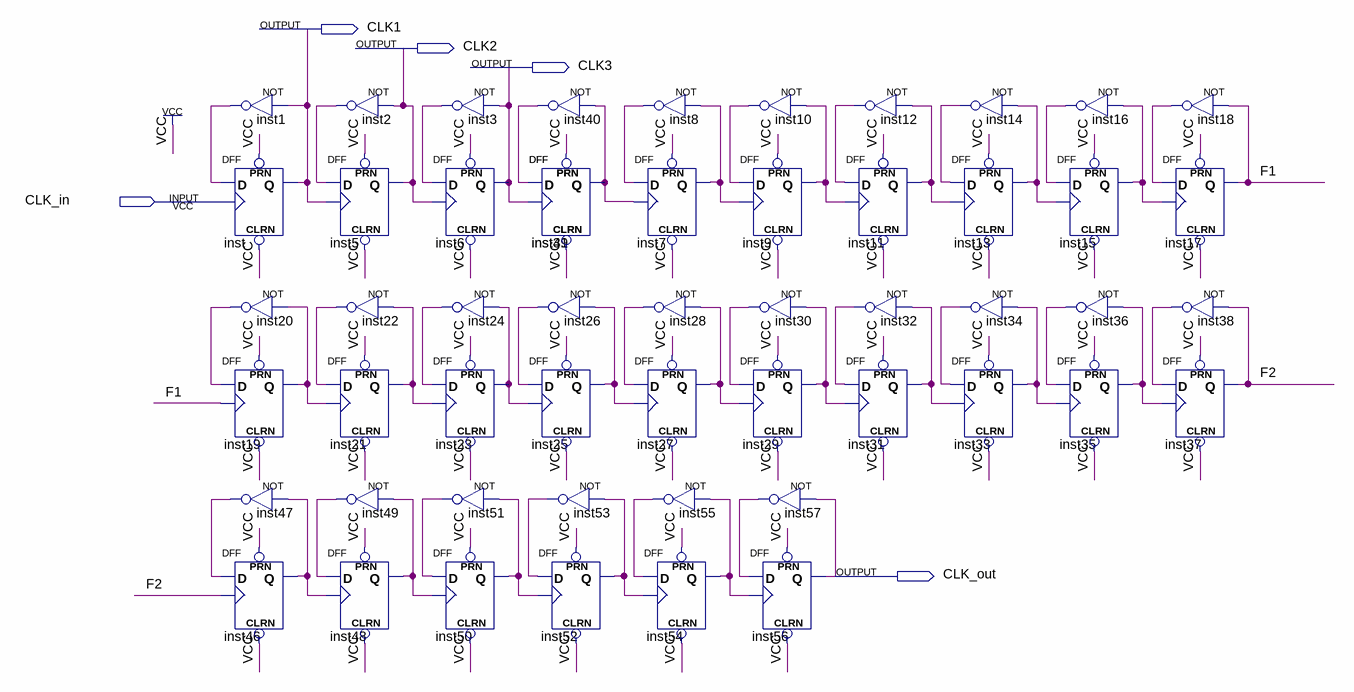
[diagram p0: schematic sheet]
// Quartus schematic divFreq.bdf as structural Verilog: 53 symbols, 5 pins
module divFreq (
  input  CLK_in,
  output CLK1,
  output CLK2,
  output CLK3,
  output CLK_out
);

  wire F1, F2, inst1_out, inst2_out, inst3_out, inst7_q, inst8_out, inst9_q, inst10_out, inst11_q,
       inst12_out, inst13_q, inst14_out, inst15_q, inst16_out, inst18_out, inst19_q, inst20_out, inst21_q,
       inst22_out, inst23_q, inst24_out, inst25_q, inst26_out, inst27_q, inst28_out, inst29_q, inst30_out,
       inst31_q, inst32_out, inst33_q, inst34_out, inst35_q, inst36_out, inst38_out, inst39_q, inst40_out,
       inst46_q, inst47_out, inst48_q, inst49_out, inst50_q, inst51_out, inst52_q, inst53_out, inst54_q,
       inst55_out, inst57_out;

  not inst1 (inst1_out, CLK1);
  DFF inst (.CLRN(1'b1), .CLK(CLK_in), .D(inst1_out), .PRN(1'b1), .Q(CLK1));
  not inst20 (inst20_out, inst19_q);
  DFF inst19 (.CLRN(1'b1), .CLK(F1), .D(inst20_out), .PRN(1'b1), .Q(inst19_q));
  not inst47 (inst47_out, inst46_q);
  DFF inst46 (.CLRN(1'b1), .CLK(F2), .D(inst47_out), .PRN(1'b1), .Q(inst46_q));
  not inst2 (inst2_out, CLK2);
  DFF inst5 (.CLRN(1'b1), .CLK(CLK1), .D(inst2_out), .PRN(1'b1), .Q(CLK2));
  not inst22 (inst22_out, inst21_q);
  DFF inst21 (.CLRN(1'b1), .CLK(inst19_q), .D(inst22_out), .PRN(1'b1), .Q(inst21_q));
  not inst49 (inst49_out, inst48_q);
  DFF inst48 (.CLRN(1'b1), .CLK(inst46_q), .D(inst49_out), .PRN(1'b1), .Q(inst48_q));
  not inst3 (inst3_out, CLK3);
  DFF inst6 (.CLRN(1'b1), .CLK(CLK2), .D(inst3_out), .PRN(1'b1), .Q(CLK3));
  not inst24 (inst24_out, inst23_q);
  DFF inst23 (.CLRN(1'b1), .CLK(inst21_q), .D(inst24_out), .PRN(1'b1), .Q(inst23_q));
  not inst51 (inst51_out, inst50_q);
  DFF inst50 (.CLRN(1'b1), .CLK(inst48_q), .D(inst51_out), .PRN(1'b1), .Q(inst50_q));
  not inst40 (inst40_out, inst39_q);
  DFF inst39 (.CLRN(1'b1), .CLK(CLK3), .D(inst40_out), .PRN(1'b1), .Q(inst39_q));
  DFF inst41 (.CLRN(1'b1), .CLK(CLK3), .D(inst40_out), .PRN(1'b1), .Q(inst39_q));
  not inst26 (inst26_out, inst25_q);
  DFF inst25 (.CLRN(1'b1), .CLK(inst23_q), .D(inst26_out), .PRN(1'b1), .Q(inst25_q));
  not inst53 (inst53_out, inst52_q);
  DFF inst52 (.CLRN(1'b1), .CLK(inst50_q), .D(inst53_out), .PRN(1'b1), .Q(inst52_q));
  not inst8 (inst8_out, inst7_q);
  DFF inst7 (.CLRN(1'b1), .CLK(inst39_q), .D(inst8_out), .PRN(1'b1), .Q(inst7_q));
  not inst28 (inst28_out, inst27_q);
  DFF inst27 (.CLRN(1'b1), .CLK(inst25_q), .D(inst28_out), .PRN(1'b1), .Q(inst27_q));
  DFF inst54 (.CLRN(1'b1), .CLK(inst52_q), .D(inst55_out), .PRN(1'b1), .Q(inst54_q));
  not inst55 (inst55_out, inst54_q);
  not inst10 (inst10_out, inst9_q);
  DFF inst9 (.CLRN(1'b1), .CLK(inst7_q), .D(inst10_out), .PRN(1'b1), .Q(inst9_q));
  not inst30 (inst30_out, inst29_q);
  DFF inst29 (.CLRN(1'b1), .CLK(inst27_q), .D(inst30_out), .PRN(1'b1), .Q(inst29_q));
  not inst57 (inst57_out, CLK_out);
  DFF inst56 (.CLRN(1'b1), .CLK(inst54_q), .D(inst57_out), .PRN(1'b1), .Q(CLK_out));
  not inst12 (inst12_out, inst11_q);
  DFF inst11 (.CLRN(1'b1), .CLK(inst9_q), .D(inst12_out), .PRN(1'b1), .Q(inst11_q));
  not inst32 (inst32_out, inst31_q);
  DFF inst31 (.CLRN(1'b1), .CLK(inst29_q), .D(inst32_out), .PRN(1'b1), .Q(inst31_q));
  DFF inst13 (.CLRN(1'b1), .CLK(inst11_q), .D(inst14_out), .PRN(1'b1), .Q(inst13_q));
  DFF inst33 (.CLRN(1'b1), .CLK(inst31_q), .D(inst34_out), .PRN(1'b1), .Q(inst33_q));
  not inst14 (inst14_out, inst13_q);
  not inst34 (inst34_out, inst33_q);
  not inst16 (inst16_out, inst15_q);
  DFF inst15 (.CLRN(1'b1), .CLK(inst13_q), .D(inst16_out), .PRN(1'b1), .Q(inst15_q));
  not inst36 (inst36_out, inst35_q);
  DFF inst35 (.CLRN(1'b1), .CLK(inst33_q), .D(inst36_out), .PRN(1'b1), .Q(inst35_q));
  not inst18 (inst18_out, F1);
  DFF inst17 (.CLRN(1'b1), .CLK(inst15_q), .D(inst18_out), .PRN(1'b1), .Q(F1));
  not inst38 (inst38_out, F2);
  DFF inst37 (.CLRN(1'b1), .CLK(inst35_q), .D(inst38_out), .PRN(1'b1), .Q(F2));
endmodule
